# EAGLE schematic breakout-ws2812 (EAGLE 6.5.0)
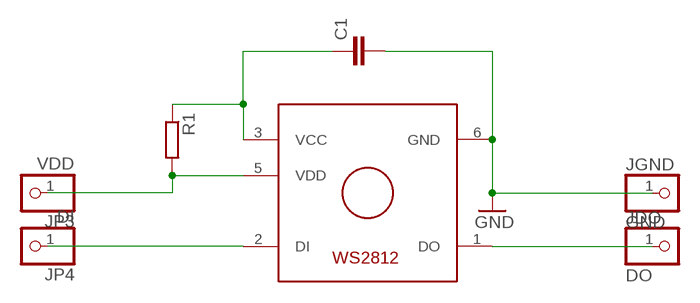
[diagram p0: schematic, sheet 1]

## Parts
C1  C-EUC1206  [C1206]
JDO  DO  PINHD-1X1  [1X01]
JGND  GND  PINHD-1X1  [1X01]
JP3  VDD  PINHD-1X1  [1X01]
JP4  DI  PINHD-1X1  [1X01]
R1  R-EU_R1206  [R1206]
U$1  WS2812  [WS2812]

## Nets
GND: C1.2 JGND.1 U$1.6(GND)
JDD: JP3.1 R1.2 U$1.5(VDD)
JDI: JP4.1 U$1.2(DI)
N$2: JDO.1 U$1.1(DO)
N$3: C1.1 R1.1 U$1.3(VCC)

## Library data of the parts
C1 = resistor:C-EU: CAPACITOR, European symbol
JDO JGND JP3 JP4 = pinhead:PINHD-1X1: PIN HEADER
R1 = resistor:R-EU_: RESISTOR, European symbol
U$1 = n39:WS2812: WS2812 — Intelligent control LED integrated light source General description WS2812 is a intelligent control LED light source that the control circuit and RGB chip are integrated in a package of 5050 components. It internal include intelligent digital port data latch and signal reshaping amplification drive circuit. Also include a precision internal oscillator and a 12V voltage programmable constant curre-nt control part, effectively ensuring the pixel point light color height consistent. The data transfer protocol use single NZR communication mode. After the pixel power-on reset, the DIN port receive data from controller, the first pixel collect initial 24bit data then sent to the internal data latch, the other data which reshaping by the internal signal reshaping amplification circuit sent to the next cascade pixel through the DO port. After transmission for each pixel,the signal to reduce 24bit. pixel adopt auto resha -ping transmit technology, making the pixel cascade number is not limited the signal transmission, only depend on the speed of signal transmission. LED with low driving voltage, environmental protection and energy saving, high brightness, scattering angle is large, good consistency, low power, long life and other advantages. The control chip integrated in LED above becoming more simple circuit, small volume, convenient installation.